# Altium schematic sheet SCH_TKHTN_GR6.SchDoc
size A; SheetNumber: 1; SheetTotal: 1
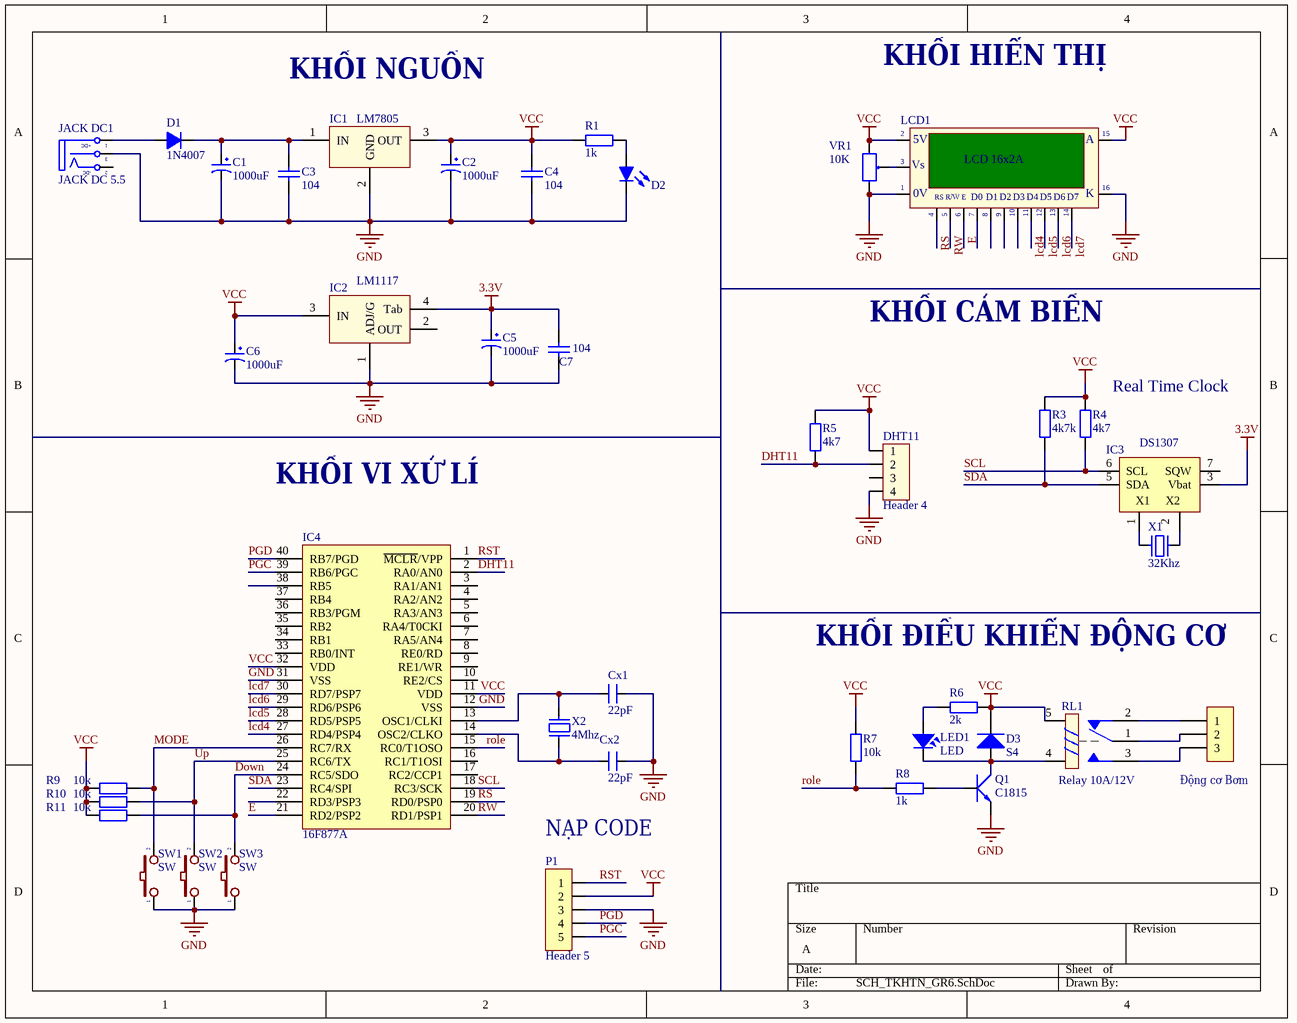
[diagram p0: SCH_TKHTN_GR6.SchDoc]

## Parts
C1  1000uF  [tu hoa 8mm]
C2  1000uF  [tu hoa 8mm]
C3  104  [tu gom]
C4  104  [tu gom]
C5  1000uF  [tu hoa 5mm]
C6  1000uF  [tu hoa 4mm]
C7  104  [tu gom]
Cx1  22pF  [CN1]
Cx2  22pF  [CN1]
D1  1N4007  [D1A]
D2  Led  [LED 5MM - RED]  (value not drawn)
D3  S4  [DIODE SOD-123]
DHT11  Header 4  [HED4]
H1  Động cơ Bơm  [Header 3P DC 2.54]
IC1  LM7805  [QTO-220]
IC2  LM1117  [SOT223-4N]
IC3  DS1307  [DIP8/W0.3]
IC4  16F877A  [DIP40/W0.6]
JACK_DC1  JACK DC 5.5  [JACK DC 5.5]
LCD1  LCD 16x2A  [LCD16X2]
LED1  LED  [L-0805]
P1  Header 5  [HDR/Header/5]
Q1  C1815  [QTO-92]
R1  1k  [tro vach 1/2w]
R3  4k7k  [tro smd 0603]
R4  4k7  [tro smd 0603]
R5  4k7  [tro smd 0603]
R6  2k  [tro smd 0603]
R7  10k  [tro smd 0603]
R8  1k  [tro smd 0603]
R9  10k  [tro smd 0603]
R10  10k  [tro smd 0603]
R11  10k  [tro smd 0603]
RL1  Relay 10A/12V  [RL_SPDT_10A]
SW1  SW  [SW2]
SW2  SW  [SW2]
SW3  SW  [SW2]
VR1  10K  [VR]
X1  32Khz  [XT2]
X2  4Mhz  [XT2]

## Nets
3.3V: C5.1 C7.1 IC2.4(Tab) IC3.3(Vbat)
GND: C1.2 C2.2 C3.2 C4.2 C5.2 C6.2 C7.2 Cx1.2 Cx2.2 D2.2(K) DHT11.4 IC1.2(GND) IC2.1(ADJ/G) IC3.4(GND) IC4.12(VSS) IC4.31(VSS) JACK_DC1.3(S) LCD1.1(GND) LCD1.16(K) P1.3 Q1.1(E) SW1.1 SW2.1 SW3.1 VR1.3
VCC: C2.1 C4.1 C6.1 D3.2(K) DHT11.1 IC1.3(OUT) IC2.3(IN) IC3.8(VCC) IC4.11(VDD) IC4.32(VDD) LCD1.2(VDD) LCD1.15(A) P1.2 R1.1 R3.2 R4.2 R5.2 R6.1 R7.2 R9.2 R10.2 R11.2 RL1.5 VR1.1
DHT11: DHT11.2 IC4.2(RA0/AN0) R5.1
Down: IC4.24(RC5/SDO) R11.1 SW3.2
E: IC4.21(RD2/PSP2) LCD1.6(~{EN})
lcd4: IC4.27(RD4/PSP4) LCD1.11(D4)
lcd5: IC4.28(RD5/PSP5) LCD1.12(D5)
lcd6: IC4.29(RD6/PSP6) LCD1.13(D6)
lcd7: IC4.30(RD7/PSP7) LCD1.14(D7)
MODE: IC4.26(RC7/RX) R9.1 SW1.2
PGC: IC4.39(RB6/PGC) P1.5
PGD: IC4.40(RB7/PGD) P1.4
role: IC4.15(RC0/T1OSO) R7.1 R8.2
RS: IC4.19(RD0/PSP0) LCD1.4(RS)
RST: IC4.1(~{MCLR}/VPP) P1.1
RW: IC4.20(RD1/PSP1) LCD1.5(R/~{W})
SCL: IC3.6(SCL) IC4.18(RC3/SCK) R4.1
SDA: IC3.5(SDA) IC4.23(RC4/SPI) R3.1
Up: IC4.25(RC6/TX) R10.1 SW2.2
NetC1_1: C1.1 C3.1 D1.2(K) IC1.1(IN)
NetCx1_1: Cx1.1 IC4.13(OSC1/CLKI) X2.2
NetCx2_1: Cx2.1 IC4.14(OSC2/CLKO) X2.1
NetD1_1: D1.1(A) JACK_DC1.1(T)
NetD2_1: D2.1(A) R1.2
NetD3_1: D3.1(A) LED1.2 Q1.2(C) RL1.4
NetH1_1: H1.1 RL1.2
NetH1_2: H1.2 RL1.1
NetH1_3: H1.3 RL1.3
NetIC3_1: IC3.1(X1) X1.1
NetIC3_2: IC3.2(X2) X1.2
NetLCD1_3: LCD1.3(VEE) VR1.2
NetLED1_1: LED1.1 R6.2
NetQ1_3: Q1.3(B) R8.1

Not connected (* = marked no-connect by the designer): DHT11 3; IC2 2(OUT); IC3 7(SQW); IC4 3(RA1/AN1) 4(RA2/AN2) 5(RA3/AN3) 6(RA4/T0CKI) 7(RA5/AN4) 8(RE0/RD) 9(RE1/WR) 10(RE2/CS) 16(RC1/T1OSI) 17(RC2/CCP1) 22(RD3/PSP3) 33(RB0/INT) 34(RB1) 35(RB2) 36(RB3/PGM) 37(RB4) 38(RB5); JACK_DC1 2(TN); LCD1 7(D0) 8(D1) 9(D2) 10(D3)

## Notes on the sheet
- KHỐI NGUỒN
- KHỐI HIỂN THỊ
- KHỐI CẢM BIẾN
- (near R4) Real Time Clock
- KHỐI VI XỬ LÍ
- KHỐI ĐIỀU KHIỂN ĐỘNG CƠ
- NẠP CODE
- (in symbol JACK DC 5.5) +DC; -DC
- (in symbol LCD16x2A) 5V; Vs; |; 0V; R/W; E

## Library data of the parts
C1 C2 = Tu Hoa 1000uF 16V 8x20: Cắm; Don_Vi: Con; So_Chan: 2; Ten_Linh_Kien: Tụ Hóa 1000uF 16V 8x20MM; Ma_Hang: MH008300; Chung_Loai: Cắm; Kieu_Chan: *
C3 C4 C7 = Tu gom 104 50V: Cắm; So_Chan: 2; Ten_Linh_Kien: Tụ gốm 104 100nF 50V; Don_Vi: Con; Ma_Hang: MH004761; Chung_Loai: Cắm; Kieu_Chan: *
C5 = Tu Hoa 22uF 25V 5x11: Cắm; So_Chan: 2; Don_Vi: Con; Ten_Linh_Kien: Tụ Hóa 22uF 25V; Ma_Hang: MH006858; Chung_Loai: Cắm; Kieu_Chan: *
C6 = Tu Hoa 10uF 16V 4x7: Cắm; So_Chan: 2; Don_Vi: Con; Ten_Linh_Kien: Tụ Hóa 10uF 16V; Ma_Hang: MH006855; Chung_Loai: Cắm; Kieu_Chan: *
Cx1 Cx2 = CN0: Cremic For Xtal 1pF => 100pF; Value: 33pF
D1 = D1A: Diode 1A; Value: 1N4007
D2 = Led: Typical LED
D3 = Diode S4: Dán; Ten_Linh_Kien: Diode S4 SOD123 ( 1N5819 SOD123); Ma_Hang: MH005519; Don_Vi: Con; Ghi_Chu: *; Chung_Loai: Dán; Kieu_Chan: *
DHT11 = Hed4: Header 4 (Green); Value: Header 4
H1 = Header 3P 2.54 Duc Cong: Cắm; Ten_Linh_Kien: Header 3P XH2.54-3P Đực Cong; Don_Vi: Con; Ma_Hang: MH001302; Chung_Loai: Cắm
IC1 = LM78xx: On ap +, from + 5 to + 24VDC; Value: LM7805
IC2 = LM1117: 3v3; Value: LM317
IC3 = DS1307: Real Timer Serial; Value: DS1307
IC4 = 16F877: 8K FLASH, 368B RAM, 256B EFROM; Value: PIC16F877A; Value: DIP 40; Copyright by: VanDungEvn
JACK_DC1 = JACK DC 5.5: Value: Jac DC
LCD1 = LCD16x2A: LCD dipslay 16 char, 2 line; Value: LCD16x2A
LED1 = LED: LED Single colour Green and Red; Value: LED 3 ly Single Colour
P1 = Header 5: Header, 5-Pin
Q1 = C1815: NPN 600mW, ECB; Value: C1815
R1 = Tro Vach 1/2W 5% 1k: Cắm; Don_Vi: Con; So_Chan: 2; Ten_Linh_Kien: Trở 5% 1/2w 1K; Ma_Hang: MH007240; Chung_Loai: Cắm; Kieu_Chan: *
R3-R11 = Tro 0603 5% 2k: Dán; Don_Vi: Con; So_Chan: 2; Ten_Linh_Kien: Trở 0603 5% 2k; Ma_Hang: MH006324; Chung_Loai: Dán; Kieu_Chan: *
RL1 = Relay 1: Relay SPDT,10A - 12VDC 5 Pin; Value: Relay SPDT, 10A, 12V
SW1-SW3 = SW2: Switch button 2 pin; Value: SW chip 2 pin
VR1 = VR: Var Resistor; Value: VR 10K
X1 = XT2: Crystal For all Crystal 2pin.; Value: 4Mhz
X2 = XT2: Crystal For all Crystal 2pin.; Value: 4Mhz